# EAGLE design USBMICRO-DX4R005JJ2_breakout (EAGLE 7.3.0)
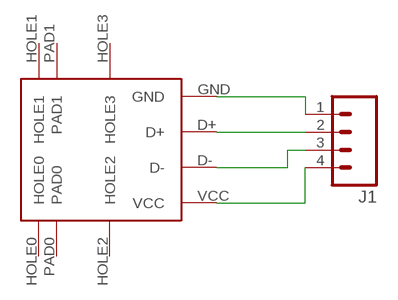
[diagram p0: schematic, sheet 1]

## Parts
J1  M04PTH  [1X04]
U$1  USBMICRO-DX4R005JJ2  [USBMICRO-DX4R005JJ2]

## Nets
N$1: J1.1 U$1.GND
N$2: J1.2 U$1.D+
N$3: J1.3 U$1.D-
N$4: J1.4 U$1.VCC
Unconnected: U$1.HOLE0 U$1.HOLE1 U$1.HOLE2 U$1.HOLE3 U$1.PAD0 U$1.PAD1

## Library data of the parts
J1 = SparkFun-Connectors:M04: Header 4 Standard 4-pin 0.1" header. Use with straight break away headers (SKU : PRT-00116), right angle break away headers (PRT-00553), swiss pins (PRT-00743), machine pins (PRT-00117), and female headers (PRT-00115). Molex polarized connector foot print use with SKU : PRT-08231 with associated crimp pins and housings. 1MM SMD Version SKU: PRT-10208; PROD_ID: CONN-09696
U$1 = awqua_eagle_library:USBMICRO-DX4R005JJ2

## Board
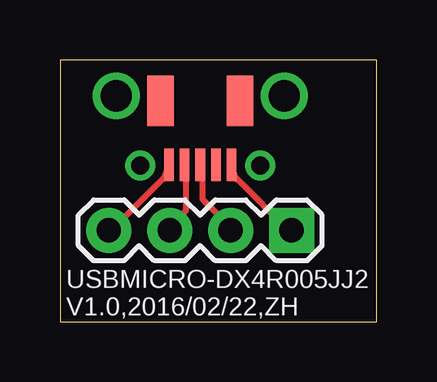
[diagram p1: board, top side]

Size 13.21 x 10.92 mm. Coordinates in mm from the lower left corner, seen from the top.
Outline: 0,0 13.21,0 13.21,10.92 0,10.92 0,0
Copper layers (1*16): Top 0.035mm / dielectric 1.5mm / Bottom 0.035mm
Design rules "default": minimum track width 10mil, minimum drill 24mil, track to track 8mil, track to pad 8mil, pad to pad 8mil, via to via 8mil, smd to smd 8mil, copper to edge 40mil, drill to drill 8mil, minimum pad ring 10mil, minimum via ring 8mil, stop-mask expansion 4mil, vias tented up to drill 0mil, thermal gap 10mil

### Footprints (pad centres in the part's own frame; a part is rotated, then mirrored left to right if it is on the bottom)
1X04 = drill 1.016 pad 1.88 square: 1 0,0 | drill 1.016 pad 1.88: 2 2.54,0; 3 5.08,0; 4 7.62,0
USBMICRO-DX4R005JJ2 = smd 0.4 x 1.35: D+ 0,4.125; D- 0.65,4.125; DNP -0.65,4.125; GND -1.3,4.125; VCC 1.3,4.125 | drill 1.3 pad 1.9: HOLE0 3.5,1.25; HOLE1 -3.5,1.25 | drill 0.75 pad 1.15: HOLE2 2.5,4.15; HOLE3 -2.5,4.15 | smd 1.1 x 2.1: PAD0 1.65,1.45; PAD1 -1.65,1.45

### Placement (x,y rotation side)
J1  9.65,3.81 180 top
U$1  5.84,10.67 180 top

### Tracks (layer width: path | path; a pad name or v marks a point on that pad's centre or on a via)
N$1
  Top 0.254: U$1.GND 7.32,5.97 7.32,6.02 9.6,3.73 J1.1
N$2
  Top 0.254: U$1.D+ 5.94,6.48 5.94,5.11 7.09,3.96 J1.2
N$3
  Top 0.254: U$1.D- 5.26,6.48 5.26,4.65 4.57,3.96 J1.3
N$4
  Top 0.254: U$1.VCC 4.34,5.97 4.34,6.02 2.06,3.73 J1.4

### Text on the board
tPlace: USBMICRO-DX4R005JJ2 / V1.0,2016/02/22,ZH